# EAGLE design Motherboard (EAGLE 8.1.1)
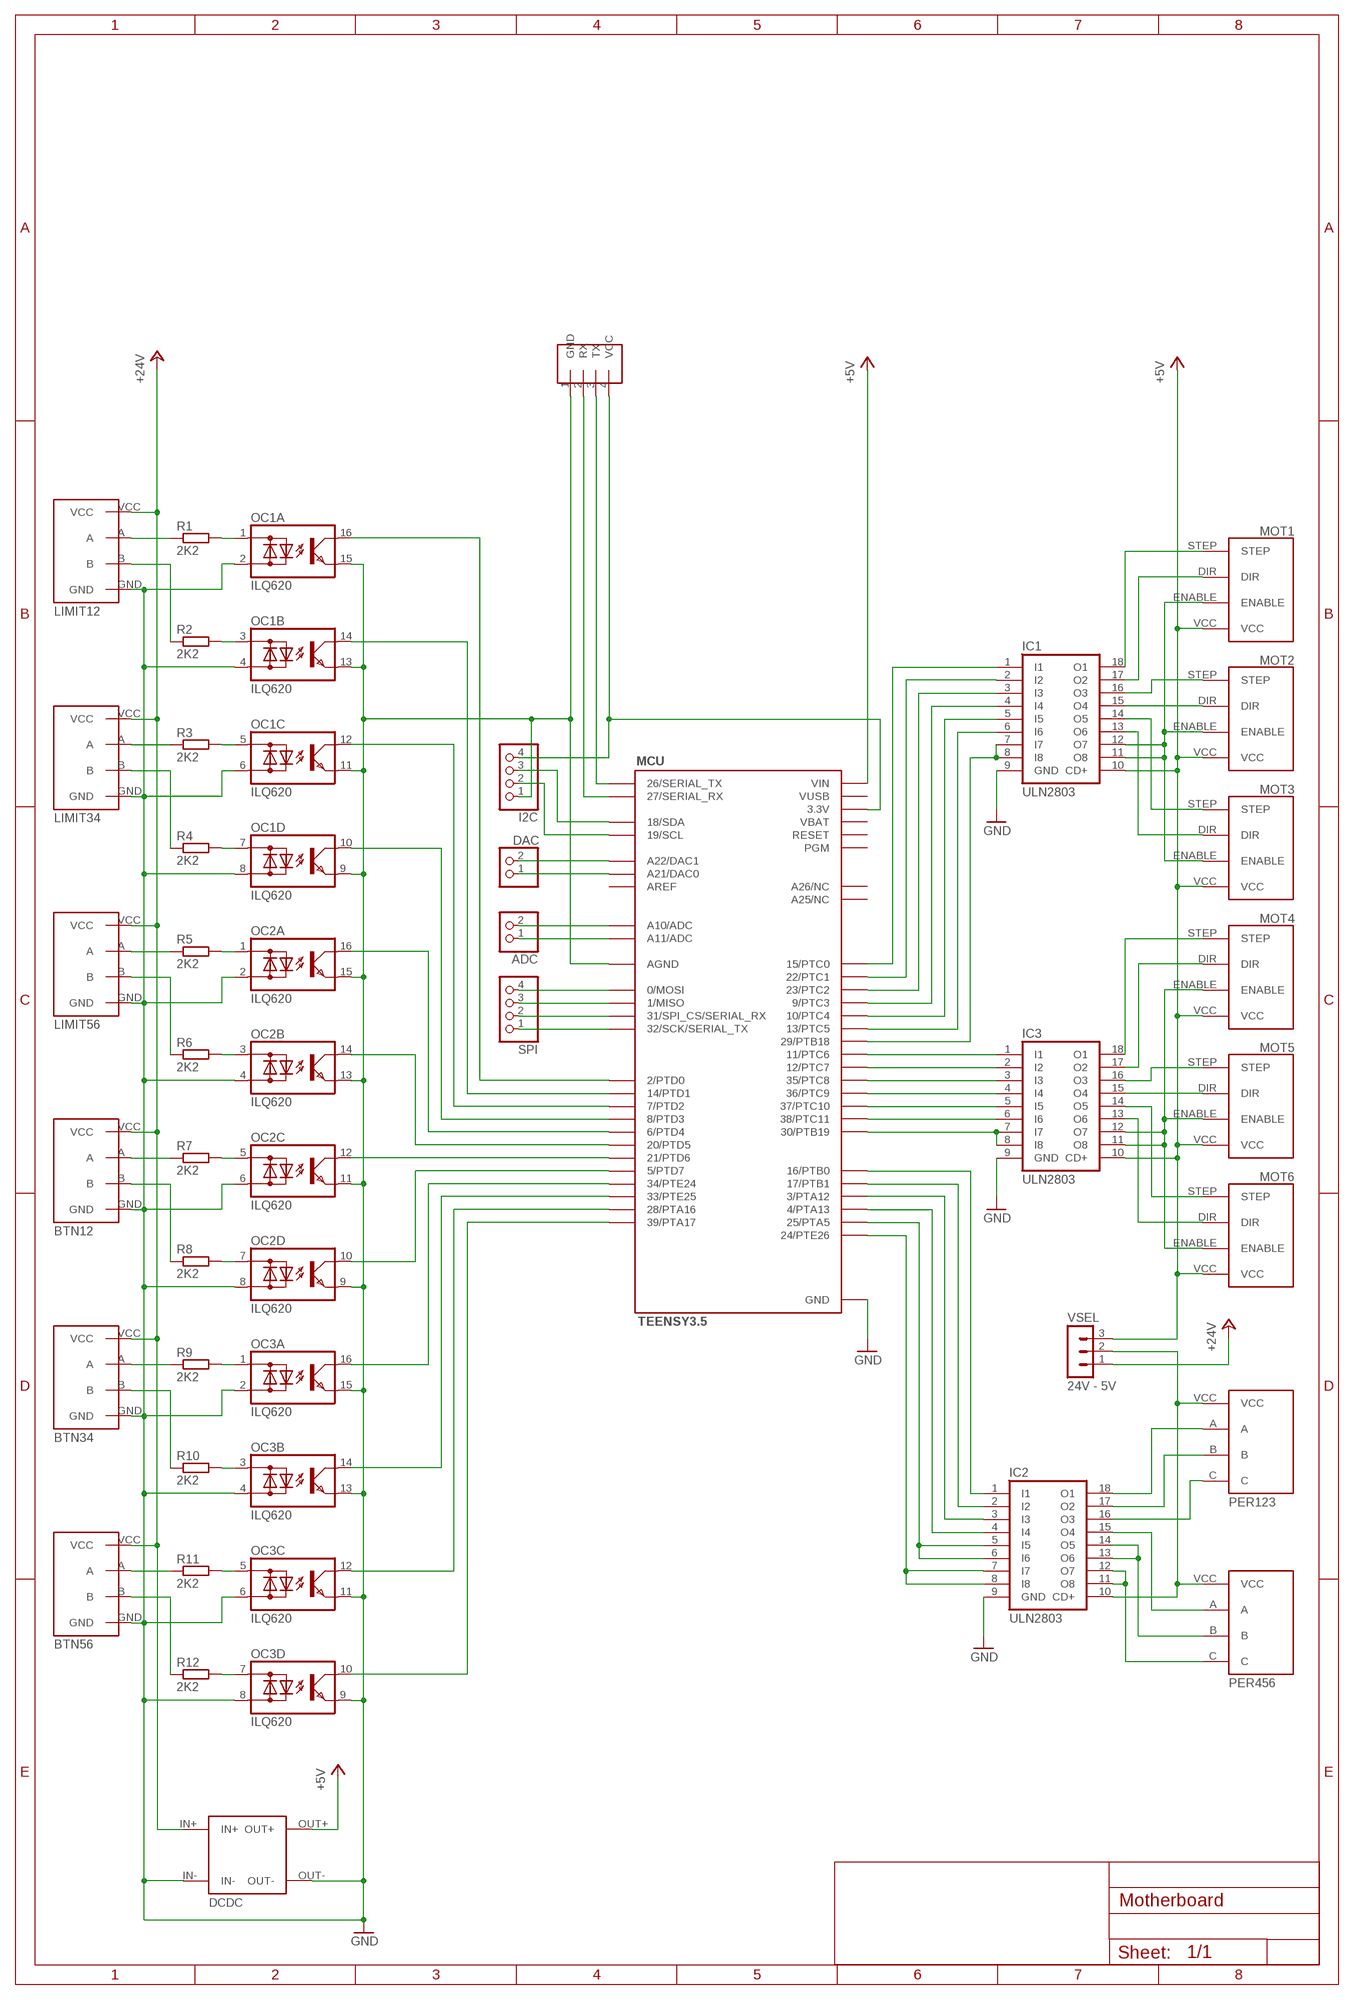
[diagram p0: schematic, sheet 1]

## Parts
ADC  PINHD-1X2  [1X02]
BTN12  CONN4B  [CONN4B]
BTN34  CONN4B  [CONN4B]
BTN56  CONN4B  [CONN4B]
DAC  PINHD-1X2  [1X02]
DCDC  DCDC  [DCDC]
I2C  PINHD-1X4  [1X04]
IC1  ULN2803  ULN2803A  [DIL18]
IC2  ULN2803  ULN2803A  [DIL18]
IC3  ULN2803  ULN2803A  [DIL18]
LIMIT12  CONN4B  [CONN4B]
LIMIT34  CONN4B  [CONN4B]
LIMIT56  CONN4B  [CONN4B]
MCU  TEENSY3.5  TEENSY_3.5_ALL_PINS  [TEENSY_3.5_ALL_PINS]
MOT1  CONN4  [CONN4]
MOT2  CONN4  [CONN4]
MOT3  CONN4  [CONN4]
MOT4  CONN4  [CONN4]
MOT5  CONN4  [CONN4]
MOT6  CONN4  [CONN4]
OC1  ILQ620  [DIL16]
OC2  ILQ620  [DIL16]
OC3  ILQ620  [DIL16]
PER123  CONN4C  [CONN4C]
PER456  CONN4C  [CONN4C]
R1  2K2  R-EU_0207/10  [0207/10]
R2  2K2  R-EU_0207/10  [0207/10]
R3  2K2  R-EU_0207/10  [0207/10]
R4  2K2  R-EU_0207/10  [0207/10]
R5  2K2  R-EU_0207/10  [0207/10]
R6  2K2  R-EU_0207/10  [0207/10]
R7  2K2  R-EU_0207/10  [0207/10]
R8  2K2  R-EU_0207/10  [0207/10]
R9  2K2  R-EU_0207/10  [0207/10]
R10  2K2  R-EU_0207/10  [0207/10]
R11  2K2  R-EU_0207/10  [0207/10]
R12  2K2  R-EU_0207/10  [0207/10]
SPI  PINHD-1X4  [1X04]
U$1  SERIAL-SUBD9-IF  [SERIAL-SUBD9-IF]
VSEL  24V - 5V  MA03-1  [MA03-1]

## Nets
3.3V: I2C.4 MCU.3.3V MCU.3.3V3(3.3V) MCU.3.3V4(3.3V) U$1.4(VCC)
+5V: DCDC.OUT+ IC1.10(CD+) IC3.10(CD+) MCU.VIN MOT1.VCC MOT2.VCC MOT3.VCC MOT4.VCC MOT5.VCC MOT6.VCC VSEL.3
+24V: BTN12.VCC BTN34.VCC BTN56.VCC DCDC.IN+ LIMIT12.VCC LIMIT34.VCC LIMIT56.VCC VSEL.1
+PER: IC2.10(CD+) PER123.VCC PER456.VCC VSEL.2
BT12A: BTN12.A R7.1
BT12AR: OC2.5(C:AC1) R7.2
BT12B: BTN12.B R8.1
BT12BR: OC2.7(D:AC1) R8.2
BT34A: BTN34.A R9.1
BT34AR: OC3.1(A:AC1) R9.2
BT34B: BTN34.B R10.1
BT34BR: OC3.3(B:AC1) R10.2
BT56A: BTN56.A R11.1
BT56AR: OC3.5(C:AC1) R11.2
BT56B: BTN56.B R12.1
BT56BR: OC3.7(D:AC1) R12.2
GND: BTN12.GND BTN34.GND BTN56.GND DCDC.IN- DCDC.OUT- I2C.1 IC1.9(GND) IC2.9(GND) IC3.9(GND) LIMIT12.GND LIMIT34.GND LIMIT56.GND MCU.AGND MCU.GND MCU.GND1(GND) MCU.GND3(GND) MCU.GND4(GND) MCU.GND6(GND) OC1.2(A:AC2) OC1.4(B:AC2) OC1.6(C:AC2) OC1.8(D:AC2) OC1.9(D:E) OC1.11(C:E) OC1.13(B:E) OC1.15(A:E) OC2.2(A:AC2) OC2.4(B:AC2) OC2.6(C:AC2) OC2.8(D:AC2) OC2.9(D:E) OC2.11(C:E) OC2.13(B:E) OC2.15(A:E) OC3.2(A:AC2) OC3.4(B:AC2) OC3.6(C:AC2) OC3.8(D:AC2) OC3.9(D:E) OC3.11(C:E) OC3.13(B:E) OC3.15(A:E) U$1.1(GND)
L12A: LIMIT12.A R1.1
L12AR: OC1.1(A:AC1) R1.2
L12B: LIMIT12.B R2.1
L12BR: OC1.3(B:AC1) R2.2
L34A: LIMIT34.A R3.1
L34AR: OC1.5(C:AC1) R3.2
L34B: LIMIT34.B R4.1
L34BR: OC1.7(D:AC1) R4.2
L56A: LIMIT56.A R5.1
L56AR: OC2.1(A:AC1) R5.2
L56B: LIMIT56.B R6.1
L56BR: OC2.3(B:AC1) R6.2
LDIR1: IC1.2(I2) MCU.22/A8(22/PTC1)
LDIR2: IC1.4(I4) MCU.9(9/PTC3)
LDIR3: IC1.6(I6) MCU.13(13/PTC5)
LDIR4: IC3.2(I2) MCU.12(12/PTC7)
LDIR5: IC3.4(I4) MCU.36/A17(36/PTC9)
LDIR6: IC3.6(I6) MCU.38/A19(38/PTC11)
LENABLE123: IC1.7(I7) IC1.8(I8) MCU.29(29/PTB18)
LENABLE456: IC3.7(I7) IC3.8(I8) MCU.30(30/PTB19)
LIN01: MCU.2(2/PTD0) OC1.16(A:C)
LIN02: MCU.14/A0(14/PTD1) OC1.14(B:C)
LIN03: MCU.7(7/PTD2) OC1.12(C:C)
LIN04: MCU.8(8/PTD3) OC1.10(D:C)
LIN05: MCU.6(6/PTD4) OC2.16(A:C)
LIN06: MCU.20/A6(20/PTD5) OC2.14(B:C)
LIN07: MCU.21/A7(21/PTD6) OC2.12(C:C)
LIN08: MCU.5(5/PTD7) OC2.10(D:C)
LIN09: MCU.34/A15(34/PTE24) OC3.16(A:C)
LIN10: MCU.33/A14(33/PTE25) OC3.14(B:C)
LIN11: MCU.28(28/PTA16) OC3.12(C:C)
LIN12: MCU.39/A20(39/PTA17) OC3.10(D:C)
LPER1A: IC2.1(I1) MCU.16/A2(16/PTB0)
LPER1B: IC2.2(I2) MCU.17/A3(17/PTB1)
LPER1C: IC2.3(I3) MCU.3(3/PTA12)
LPER2A: IC2.4(I4) MCU.4(4/PTA13)
LPER2B: IC2.5(I5) IC2.6(I6) MCU.25(25/PTA5)
LPER2C: IC2.7(I7) IC2.8(I8) MCU.24(24/PTE26)
LSTEP1: IC1.1(I1) MCU.15/A1(15/PTC0)
LSTEP2: IC1.3(I3) MCU.23/A9(23/PTC2)
LSTEP3: IC1.5(I5) MCU.10(10/PTC4)
LSTEP4: IC3.1(I1) MCU.11(11/PTC6)
LSTEP5: IC3.3(I3) MCU.35/A16(35/PTC8)
LSTEP6: IC3.5(I5) MCU.37/A18(37/PTC10)
M1DIR: IC1.17(O2) MOT1.DIR
M1STEP: IC1.18(O1) MOT1.STEP
M2DIR: IC1.15(O4) MOT2.DIR
M2STEP: IC1.16(O3) MOT2.STEP
M3DIR: IC1.13(O6) MOT3.DIR
M3STEP: IC1.14(O5) MOT3.STEP
M4DIR: IC3.17(O2) MOT4.DIR
M4STEP: IC3.18(O1) MOT4.STEP
M5DIR: IC3.15(O4) MOT5.DIR
M5STEP: IC3.16(O3) MOT5.STEP
M6DIR: IC3.13(O6) MOT6.DIR
M6STEP: IC3.14(O5) MOT6.STEP
M123ENABLE: IC1.11(O8) IC1.12(O7) MOT1.ENABLE MOT2.ENABLE MOT3.ENABLE
M456ENABLE: IC3.11(O8) IC3.12(O7) MOT4.ENABLE MOT5.ENABLE MOT6.ENABLE
N$1: I2C.3 MCU.18/A4(18/SDA)
N$2: I2C.2 MCU.19/A5(19/SCL)
N$3: DAC.2 MCU.A22(A22/DAC1)
N$4: DAC.1 MCU.A21(A21/DAC0)
N$5: ADC.2 MCU.A10(A10/ADC)
N$6: ADC.1 MCU.A11(A11/ADC)
N$7: MCU.0(0/MOSI) SPI.4
N$8: MCU.1(1/MISO) SPI.3
N$9: MCU.31/A12(31/SPI_CS/SERIAL_RX) SPI.2
N$10: MCU.32/A13(32/SCK/SERIAL_TX) SPI.1
PER123A: IC2.18(O1) PER123.A
PER123B: IC2.17(O2) PER123.B
PER123C: IC2.16(O3) PER123.C
PER456A: IC2.15(O4) PER456.A
PER456B: IC2.13(O6) IC2.14(O5) PER456.B
PER456C: IC2.11(O8) IC2.12(O7) PER456.C
SERIALRX: MCU.27(27/SERIAL_RX) U$1.2(RX)
SERIALTX: MCU.26(26/SERIAL_TX) U$1.3(TX)
Unconnected: MCU.A25(A25/NC) MCU.A26(A26/NC) MCU.PGM MCU.RESET

## Power pins joined to a net without a drawn wire
AREF: MCU.AREF
VBAT: MCU.VBAT
VUSB: MCU.VUSB

## Library data of the parts
ADC DAC = pinhead:PINHD-1X2: PIN HEADER
BTN12 BTN34 BTN56 LIMIT12 LIMIT34 LIMIT56 = Mooov2:CONN4B
DCDC = Mooov2:DCDC
I2C SPI = pinhead:PINHD-1X4: PIN HEADER
IC1-IC3 = uln-udn:ULN2803A: DRIVER ARRAY
MCU = Mooov2:TEENSY_3.5_ALL_PINS: All PIN version of the Teensy 3.5. Note: the NC pin is not shown in symbol package, not connected here either.
MOT1-MOT6 = Mooov2:CONN4
OC1-OC3 = optocoupler2:ILQ620: SIEMENS OPTO COUPLER
PER123 PER456 = Mooov2:CONN4C
R1-R12 = rcl:R-EU_: RESISTOR, European symbol
U$1 = Mooov2:SERIAL-SUBD9-IF
VSEL = con-lstb:MA03-1: PIN HEADER; OC_FARNELL: unknown; OC_NEWARK: unknown

## Board
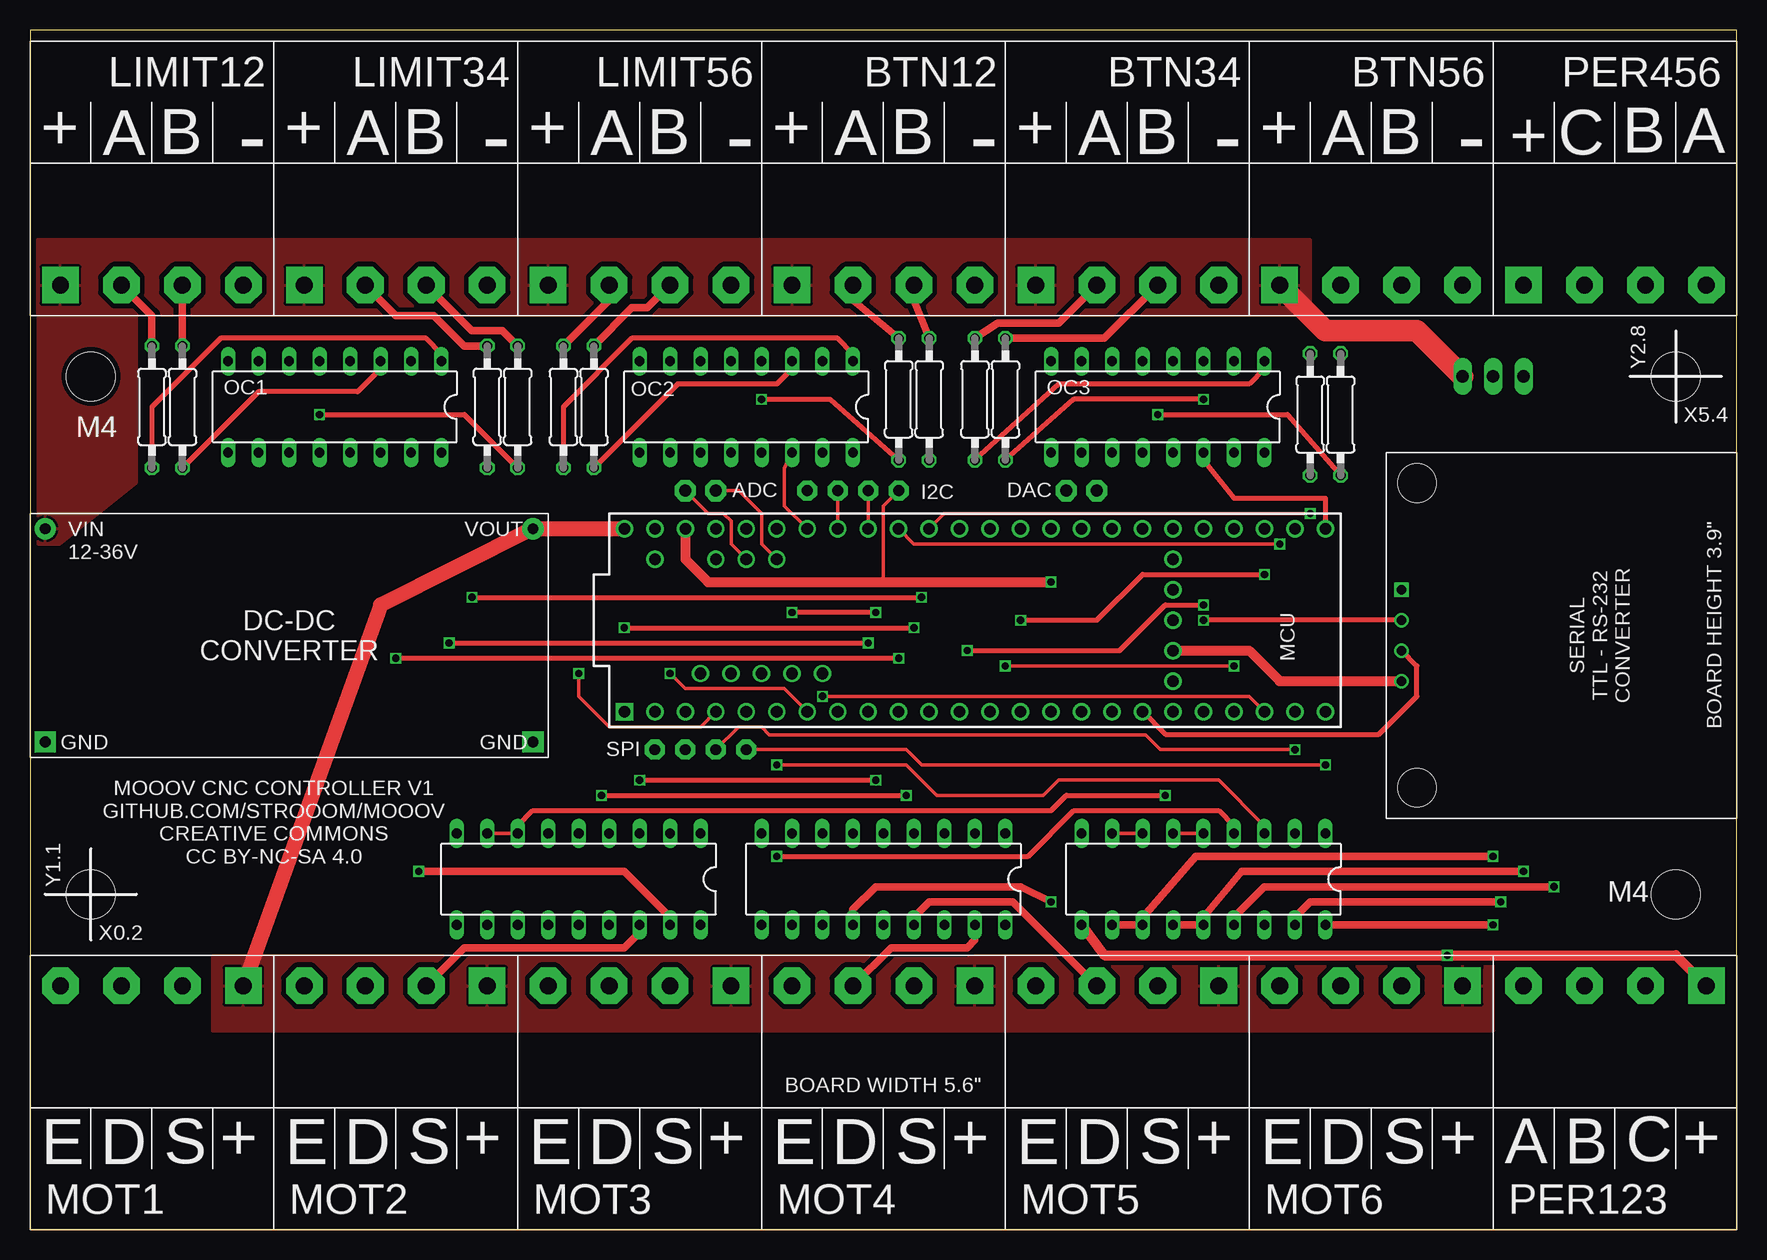
[diagram p1: board, top side]
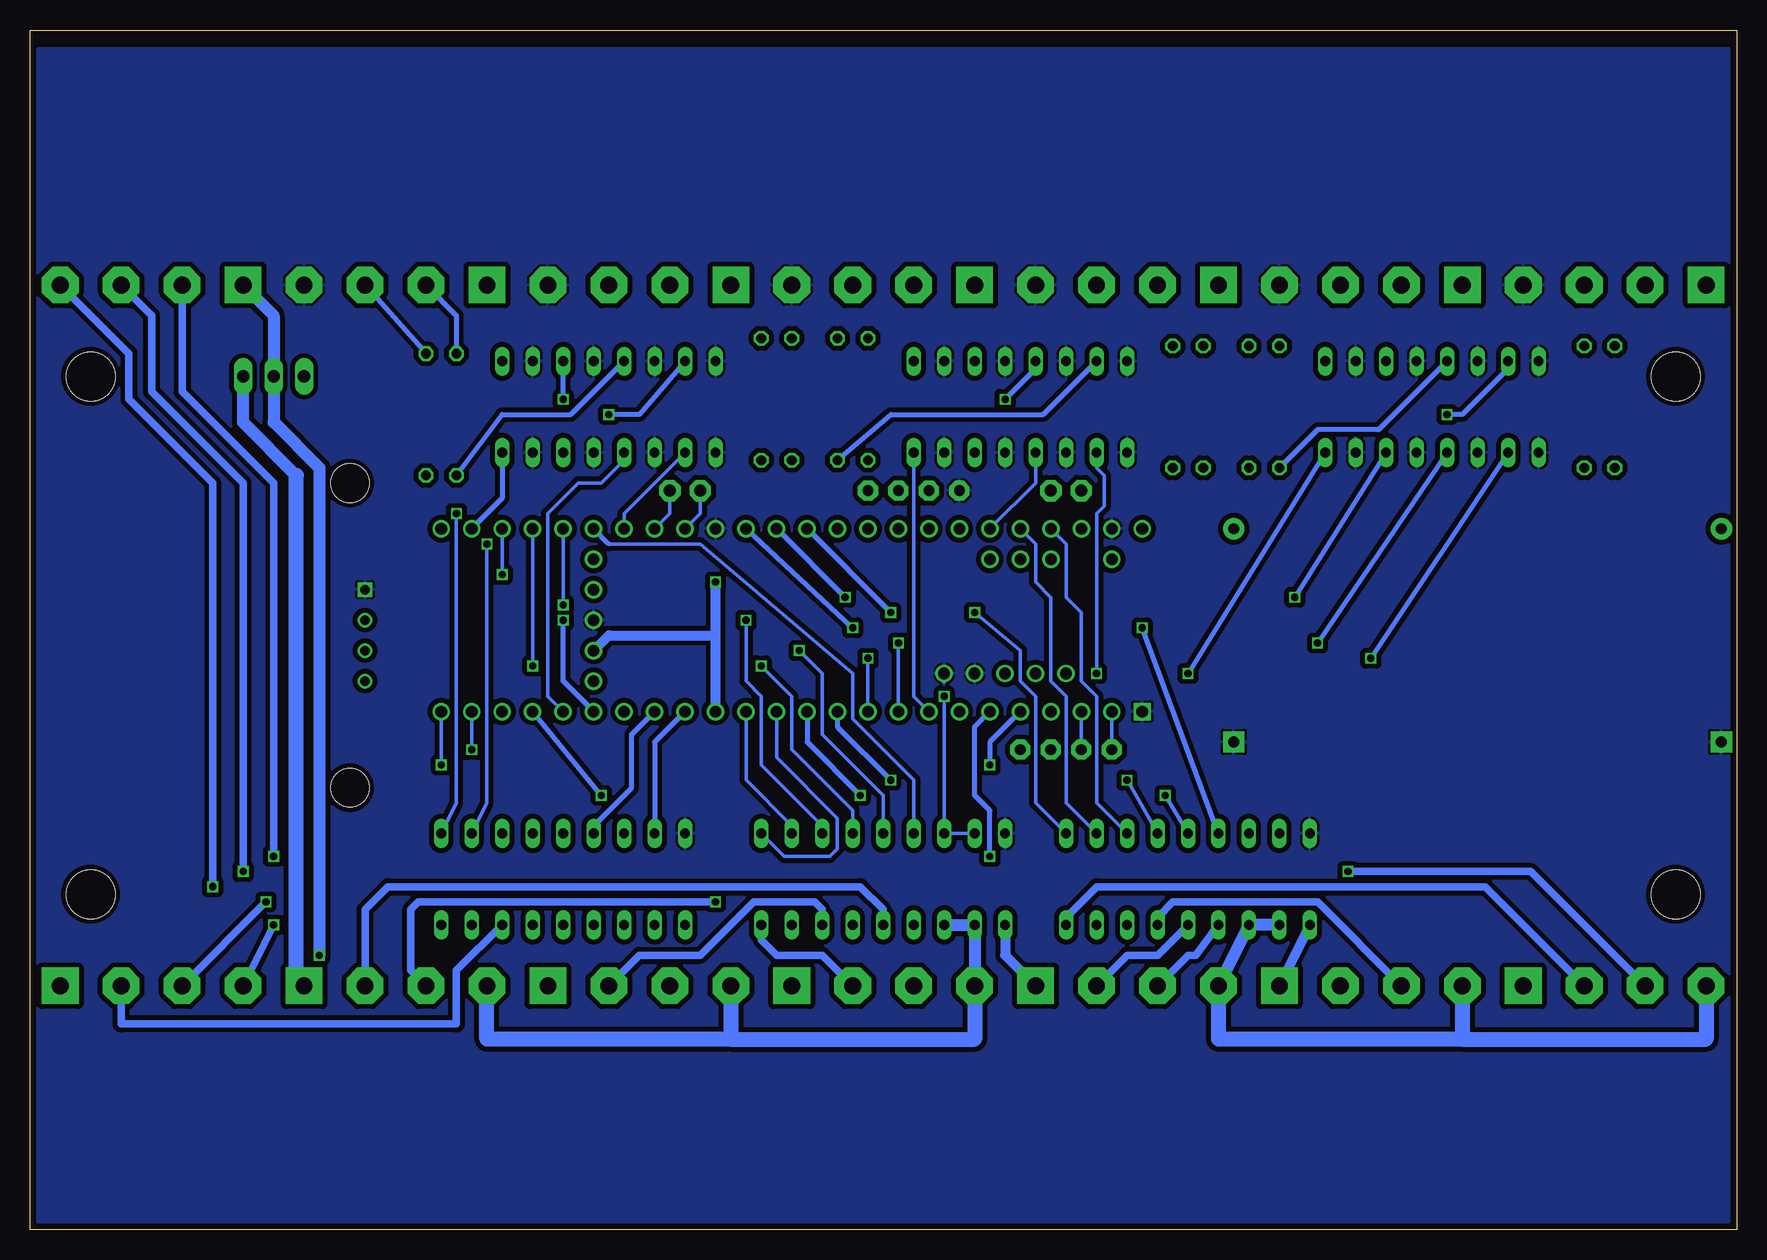
[diagram p2: board, bottom side, seen from below]

Size 142.22 x 100 mm. Coordinates in mm from the lower left corner, seen from the top.
Outline: 0,0 142.22,0 142.22,100 0,100 0,0
Copper layers (1*16): Top 0.018mm / dielectric 1.55mm / Bottom 0.018mm
Design rules "eC_2Layer_PClass6_BaseCopperO18_eCDefault *": minimum track width 10mil, minimum drill 0.35mm, track to track 10mil, track to pad 10mil, pad to pad 10mil, via to via 10mil, smd to smd 0mil, copper to edge 0.25mm, drill to drill 0.35mm, minimum pad ring 0.175mm, minimum via ring 0.125mm, stop-mask expansion 0mil, vias tented up to drill 0.45mm, thermal gap 0.2mm
Holes 4.06 mm at 5.08,27.94 5.08,71.12 137.16,71.12 137.16,27.94

### Footprints (pad centres in the part's own frame; a part is rotated, then mirrored left to right if it is on the bottom)
1X02 = drill 1.016 pad 1.778 octagon: 1 -1.27,0; 2 1.27,0
CONN4B = drill 1.4 pad 3.048 octagon: A 0,-5.08; B 0,-10.16; GND 0,-15.24 | drill 1.4 pad 3.048 square: VCC 0,0
DCDC = drill 0.9 pad 1.778: IN+ 0,0; OUT+ 40.64,0 | drill 0.9 pad 1.778 square: IN- 0,-17.78; OUT- 40.64,-17.78
1X04 = drill 0.9 pad 1.676 octagon: 1 -3.81,0; 2 -1.27,0; 3 1.27,0; 4 3.81,0
DIL18 = drill 0.813 long: 1 -10.16,-3.81; 2 -7.62,-3.81; 3 -5.08,-3.81; 4 -2.54,-3.81; 5 0,-3.81; 6 2.54,-3.81; 7 5.08,-3.81; 8 7.62,-3.81; 9 10.16,-3.81; 10 10.16,3.81; 11 7.62,3.81; 12 5.08,3.81; 13 2.54,3.81; 14 0,3.81; 15 -2.54,3.81; 16 -5.08,3.81; 17 -7.62,3.81; 18 -10.16,3.81
TEENSY_3.5_ALL_PINS = drill 0.965: 0 -7.62,27.94; 1 -7.62,25.4; 2 -7.62,22.86; 3 -7.62,20.32; 3.3V 7.62,25.4; 3.3V3 -7.62,-5.08; 3.3V4 -2.54,-15.24; 4 -7.62,17.78; 5 -7.62,15.24; 6 -7.62,12.7; 7 -7.62,10.16; 8 -7.62,7.62; 9 -7.62,5.08; 10 -7.62,2.54; 11 -7.62,0; 12 -7.62,-2.54; 13 7.62,-2.54; 14/A0 7.62,0; 15/A1 7.62,2.54; 16/A2 7.62,5.08; 17/A3 7.62,7.62; 18/A4 7.62,10.16; 19/A5 7.62,12.7; 20/A6 7.62,15.24; 21/A7 7.62,17.78; 22/A8 7.62,20.32; 23/A9 7.62,22.86; 24 -7.62,-7.62; 25 -7.62,-10.16; 26 -7.62,-12.7; 27 -7.62,-15.24; 28 -7.62,-17.78; 29 -7.62,-20.32; 30 -7.62,-22.86; 31/A12 -7.62,-25.4; 32/A13 -7.62,-27.94; 33/A14 7.62,-27.94; 34/A15 7.62,-25.4; 35/A16 7.62,-22.86; 36/A17 7.62,-20.32; 37/A18 7.62,-17.78; 38/A19 7.62,-15.24; 39/A20 7.62,-12.7; A10 5.08,20.32; A11 5.08,17.78; A21 7.62,-10.16; A22 7.62,-7.62; A25 -4.445,19.05; A26 -4.445,21.59; AGND 7.62,27.94; AREF 5.08,22.86; GND1 7.62,-5.08; GND3 -4.445,16.51; GND4 -4.445,13.97; GND6 0,-15.24; NC -4.445,24.13; PGM 2.54,-15.24; RESET 5.08,-15.24; VBAT -5.08,-15.24; VIN 7.62,30.48; VUSB 5.08,27.94 | drill 0.965 square: GND -7.62,30.48
CONN4 = drill 1.4 pad 3.048 octagon: DIR 0,-10.16; ENABLE 0,-15.24; STEP 0,-5.08 | drill 1.4 pad 3.048 square: VCC 0,0
DIL16 = drill 0.813 long: 1 -8.89,-3.81; 2 -6.35,-3.81; 3 -3.81,-3.81; 4 -1.27,-3.81; 5 1.27,-3.81; 6 3.81,-3.81; 7 6.35,-3.81; 8 8.89,-3.81; 9 8.89,3.81; 10 6.35,3.81; 11 3.81,3.81; 12 1.27,3.81; 13 -1.27,3.81; 14 -3.81,3.81; 15 -6.35,3.81; 16 -8.89,3.81
CONN4C = drill 1.4 pad 3.048 octagon: A 0,-15.24; B 0,-10.16; C 0,-5.08 | drill 1.4 pad 3.048 square: VCC 0,0
0207/10 = drill 0.813 octagon: 1 -5.08,0; 2 5.08,0
SERIAL-SUBD9-IF = drill 0.8 square: 1 0,0 | drill 0.8: 2 0,-2.54; 3 0,-5.08; 4 0,-7.62 | hole 3.2: 1.27,8.89; 1.27,-16.51
MA03-1 = drill 1.016 long: 1 -2.54,0; 2 0,0; 3 2.54,0

### Placement (x,y rotation side)
ADC  55.88,61.59 180 top
BTN12  63.5,78.74 90 top
BTN34  83.82,78.74 90 top
BTN56  104.14,78.74 90 top
DAC  87.63,61.59 180 top
DCDC  1.27,58.42 0 top
I2C  68.58,61.59 0 top
IC1  45.72,29.21 180 top
IC2  97.79,29.21 180 top
IC3  71.12,29.21 180 top
LIMIT12  2.54,78.74 90 top
LIMIT34  22.86,78.74 90 top
LIMIT56  43.18,78.74 90 top
MCU  80.01,50.8 90 top
MOT1  17.78,20.32 270 top
MOT2  38.1,20.32 270 top
MOT3  58.42,20.32 270 top
MOT4  78.74,20.32 270 top
MOT5  99.06,20.32 270 top
MOT6  119.38,20.32 270 top
OC1  25.4,68.58 180 top
OC2  59.69,68.58 180 top
OC3  93.98,68.58 180 top
PER123  139.7,20.32 270 top
PER456  124.46,78.74 90 top
R1  10.16,68.58 270 top
R2  12.7,68.58 270 top
R3  38.1,68.58 270 top
R4  40.64,68.58 270 top
R5  44.45,68.58 270 top
R6  46.99,68.58 270 top
R7  72.39,69.22 270 top
R8  74.93,69.22 270 top
R9  78.74,69.22 270 top
R10  81.28,69.22 270 top
R11  106.68,67.94 270 top
R12  109.22,67.94 270 top
SPI  55.88,40.01 180 top
U$1  114.3,53.34 0 top
VSEL  121.92,71.12 0 top

### Tracks (layer width: path | path; a pad name or v marks a point on that pad's centre or on a via)
3.3V  (via drill 0.6)
  Top 0.305: I2C.4 71.12,60.33 71.12,53.98
  Top 0.813: MCU.3.3V 54.61,55.88 56.52,53.98 71.12,53.98 v85.09,53.98 | MCU.3.3V4 101.6,48.26 104.14,45.72 U$1.4
  Bottom 0.813: MCU.3.3V3 85.09,49.53 | MCU.3.3V4 93.98,49.53 85.09,49.53 | 85.09,49.53 v85.09,53.98
+5V
  Top 1.27: MOT1.VCC 29.21,52.07 DCDC.OUT+ MCU.VIN
  Bottom 0.813: IC1.10 MOT2.VCC | IC3.10 60.96,22.86 MOT3.VCC
  Bottom 1.016: MOT6.VCC 120.02,20.95 | 120.02,62.87 124.46,67.31 VSEL.3
  Bottom 1.27: 120.02,20.95 120.02,62.87
  pour Top (isolate 0.406): 15.24,22.86 121.92,22.86 121.92,16.51 15.24,16.51
+24V
  Top 1.778: BTN56.VCC 107.95,74.93 115.57,74.93 VSEL.1
  pour Top (isolate 0.406): 0.64,76.2 0.64,57.15 2.54,57.15 8.89,62.23 8.89,76.2 1.27,76.2
  pour Top (isolate 0.406): 0.64,82.55 106.68,82.55 106.68,76.2 0.64,76.2
+PER  (via drill 0.6)
  Top 0.813: PER123.VCC 137.16,22.86 v118.11,22.86 89.53,22.86 IC2.10
  Bottom 1.016: PER456.VCC 121.92,76.2 VSEL.2 121.92,67.31 118.11,63.5 v118.11,22.86
BT12A
  Top 0.61: BTN12.A 68.58,77.47 R7.1
BT12AR  (via drill 0.6)
  Top 0.406: v60.96,69.22 66.67,69.22 R7.2
  Bottom 0.305: OC2.5 58.42,71.75
  Bottom 0.406: 58.42,71.75 v60.96,69.22
BT12B
  Top 0.61: R8.1 73.66,77.47 BTN12.B
BT12BR
  Bottom 0.406: OC2.7 57.78,67.94 70.48,67.94 R8.2
BT34A
  Top 0.61: BTN34.A 85.72,75.56 80.64,75.56 R9.1
BT34AR
  Top 0.406: OC3.1 102.87,71.75 101.6,70.48 85.72,70.48 R9.2
BT34B
  Top 0.61: BTN34.B 89.53,74.3 R10.1
BT34BR  (via drill 0.6)
  Top 0.406: v97.79,69.22 87,69.22 R10.2
  Bottom 0.406: v97.79,69.22 OC3.3
BT56A
  Bottom 0.406: BTN56.A 106.68,76.2 R11.1
BT56AR
  Bottom 0.406: OC3.5 97.16,67.94 102.87,67.94 R11.2
BT56B
  Bottom 0.406: BTN56.B R12.1
BT56BR  (via drill 0.6)
  Top 0.406: v93.98,67.94 104.78,67.94 R12.2
  Bottom 0.406: OC3.7 91.44,67.94 v93.98,67.94
GND
  Bottom 0.406: MCU.GND4 66.04,45.72
  pour Bottom (isolate 0.406): 0.64,0.64 0.64,98.42 141.6,98.42 141.6,0.64
L12A
  Top 0.61: R1.1 10.16,76.2 LIMIT12.A
L12AR
  Top 0.406: OC1.1 34.29,73.03 33.02,74.3 15.88,74.3 10.16,68.58 R1.2
L12B
  Top 0.61: R2.1 LIMIT12.B
L12BR
  Top 0.406: OC1.3 29.21,71.75 27.3,69.85 19.05,69.85 R2.2
L34A
  Top 0.61: R3.1 36.2,73.66 33.66,76.2 30.48,76.2 LIMIT34.A
L34AR
  Bottom 0.406: OC1.5 29.84,66.67 34.92,66.67 R3.2
L34B
  Top 0.61: LIMIT34.B 36.83,74.93 39.37,74.93 R4.1
L34BR  (via drill 0.6)
  Top 0.406: v24.13,67.94 36.2,67.94 R4.2
  Bottom 0.406: OC1.7 19.05,71.75 22.86,67.94 v24.13,67.94
L56A
  Top 0.61: R5.1 48.26,77.47 LIMIT56.A
L56AR
  Top 0.406: OC2.1 68.58,73.03 67.31,74.3 50.16,74.3 44.45,68.58 R5.2
L56B
  Top 0.61: LIMIT56.B 51.44,76.83 50.16,76.83 R6.1
L56BR
  Top 0.305: 47.31,63.82 R6.2
  Top 0.406: OC2.3 63.5,71.75 62.23,70.48 53.98,70.48 47.31,63.82
LDIR1
  Bottom 0.305: MCU.22/A8 58.42,57.15 58.42,53.98 57.15,52.7 57.15,45.72 55.88,44.45 55.88,35.6 55.87,35.55 IC1.2
LDIR2  (via drill 0.6)
  Top 0.406: v50.8,37.47 v70.48,37.47
  Bottom 0.305: IC1.4 v50.8,37.47
  Bottom 0.406: MCU.9 74.93,41.91 v70.48,37.47
LDIR3  (via drill 0.6)
  Top 0.406: v49.53,50.16 v73.66,50.16
  Bottom 0.406: IC1.6 v49.53,50.16 | MCU.13 v73.66,50.16
LDIR4
  Bottom 0.305: IC3.2 78.74,33.66 82.55,37.47 MCU.12
LDIR5  (via drill 0.6)
  Top 0.305: v81.28,46.99 v100.33,46.99
  Bottom 0.305: v100.33,46.99 MCU.36/A17 | IC3.4 73.66,34.92 78.74,40.01 78.74,44.45 v81.28,46.99
LDIR6
  Bottom 0.305: IC3.6 68.58,37.47 73.66,42.55 73.66,46.35 86.36,57.15 93.98,57.15
  Bottom 0.406: 93.98,57.15 MCU.38/A19
LENABLE123  (via drill 0.6)
  Top 0.305: IC1.8 IC1.7
  Top 0.406: IC1.7 40.64,33.66 41.91,34.92 85.09,34.92 86.36,36.2 v94.61,36.2
  Bottom 0.406: v94.61,36.2 MCU.29
LENABLE456  (via drill 0.6)
  Top 0.305: v66.04,44.45 101.6,44.45 MCU.30
  Bottom 0.305: IC3.8 IC3.7 v66.04,44.45
LIN01  (via drill 0.6)
  Top 0.305: MCU.2 55.88,41.91 48.26,41.91 45.72,44.45 v45.72,46.35
  Bottom 0.406: OC1.16 v45.72,46.35
LIN02  (via drill 0.6)
  Top 0.406: v36.83,52.7 v74.3,52.7
  Bottom 0.406: OC1.14 v36.83,52.7 | MCU.14/A0 v74.3,52.7
LIN03  (via drill 0.6)
  Top 0.406: v34.92,48.9 v69.85,48.9
  Bottom 0.305: MCU.7 v69.85,48.9
  Bottom 0.406: OC1.12 v34.92,48.9
LIN04  (via drill 0.6)
  Top 0.406: v72.39,47.62 v30.48,47.62
  Bottom 0.305: MCU.8 v72.39,47.62
  Bottom 0.406: OC1.10 v30.48,47.62
LIN05
  Bottom 0.305: MCU.6 68.58,44.45 OC2.16
LIN06
  Top 0.305: OC2.14 62.87,63.5 62.87,60.33 MCU.20/A6
LIN07
  Bottom 0.305: MCU.21/A7 58.42,62.23 OC2.12
LIN08  (via drill 0.6)
  Top 0.305: v53.34,46.35 54.61,45.09 62.87,45.09 MCU.5
  Bottom 0.305: OC2.10 53.34,63.5 52.7,62.87 52.7,60.33 53.34,59.69 v53.34,46.35
LIN09
  Bottom 0.406: OC3.16 102.87,60.96 MCU.34/A15
LIN10
  Top 0.406: OC3.14 97.79,64.14 100.33,60.96 107.95,60.96 MCU.33/A14
LIN11
  Bottom 0.305: MCU.28 99.06,44.45 99.06,59.69 96.52,62.23 94.61,62.23 92.71,64.14 OC3.12
LIN12
  Bottom 0.305: OC3.10 92.71,59.69 MCU.39/A20
LPER1A  (via drill 0.6)
  Top 0.305: MCU.16/A2 76.2,59.69 v106.68,59.69
  Bottom 0.305: IC2.1 106.68,35.56 v106.68,59.69
LPER1B  (via drill 0.6)
  Top 0.305: MCU.17/A3 73.66,57.15 v104.14,57.15
  Bottom 0.305: IC2.2 104.14,35.56 v104.14,57.15
LPER1C  (via drill 0.6)
  Top 0.305: v62.23,38.73 73.03,38.73 75.56,36.2 84.45,36.2 85.72,37.47 99.06,37.47 102.87,33.66 IC2.3
  Bottom 0.406: MCU.3 62.23,40.64 v62.23,38.73
LPER2A  (via drill 0.6)
  Top 0.406: IC2.4 100.33,33.66 99.06,34.92 87,34.92 83.19,31.11 v62.23,31.11
  Bottom 0.406: v62.23,31.11 62.23,34.92 63.5,36.2 63.5,41.91 MCU.4
LPER2B
  Top 0.305: IC2.5 IC2.6
  Bottom 0.406: IC2.6 95.25,33.66 92.08,36.83 92.08,41.27 MCU.25
LPER2C
  Top 0.305: IC2.8 IC2.7
  Bottom 0.406: MCU.24 90.17,40.64 IC2.8
LSTEP1  (via drill 0.6)
  Top 0.406: v70.48,51.44 v63.5,51.44
  Bottom 0.305: v63.5,51.44 59.69,48.26 59.69,45.72 58.42,44.45 58.42,35.56 IC1.1
  Bottom 0.406: v70.48,51.44 MCU.15/A1
LSTEP2
  Bottom 0.305: IC1.3 53.33,35.55 53.34,35.6 53.34,44.45 54.61,45.72 54.61,51.44 55.88,52.7 55.88,57.15 MCU.23/A9
LSTEP3  (via drill 0.6)
  Top 0.406: v47.62,36.2 v73.03,36.2
  Bottom 0.305: IC1.5 v47.62,36.2
  Bottom 0.406: MCU.10 77.47,40.64 v73.03,36.2
LSTEP4
  Bottom 0.305: IC3.1 79.38,31.11 75.56,31.11 74.93,31.75 74.93,34.29 80.01,39.37 MCU.11
LSTEP5  (via drill 0.6)
  Top 0.406: v82.55,50.8 88.9,50.8 92.71,54.61 v102.87,54.61
  Bottom 0.305: v102.87,54.61 MCU.35/A16 | IC3.3 76.2,33.66 81.28,38.73 81.28,44.45 82.55,45.72 v82.55,50.8
LSTEP6  (via drill 0.6)
  Top 0.406: v78.11,48.26 90.81,48.26 94.61,52.07 v97.79,52.07
  Bottom 0.305: v78.11,48.26 76.2,46.35 76.2,41.27 71.12,36.2 IC3.5 | v97.79,52.07 MCU.37/A18
M1DIR  (via drill 0.6)
  Top 0.61: IC1.17 53.34,26.04 49.53,29.84 v32.38,29.84
  Bottom 0.61: MOT1.DIR 17.14,29.84 v32.38,29.84
M1STEP
  Bottom 0.61: IC1.18 55.88,26.04 53.34,28.57 20.95,28.57 MOT1.STEP
M2DIR
  Bottom 0.61: IC1.15 48.26,26.04 46.99,27.3 34.92,27.3 MOT2.DIR
M2STEP
  Top 0.61: IC1.16 50.8,24.77 49.53,23.5 36.2,23.5 MOT2.STEP
M3DIR
  Bottom 0.61: MOT3.DIR 45.72,22.86 45.09,22.86 IC1.13
M3STEP
  Bottom 0.61: MOT3.STEP 50.8,22.86 48.26,22.86 IC1.14
M4DIR
  Top 0.61: MOT4.DIR 71.75,23.5 78.11,23.5 78.74,24.13 IC3.17
M4STEP
  Bottom 0.61: MOT4.STEP 76.2,22.86 80.01,22.86 81.28,24.13 IC3.18
M5DIR
  Top 0.61: MOT5.DIR 81.92,27.3 74.93,27.3 73.66,26.04 IC3.15
M5STEP
  Bottom 0.61: MOT5.STEP 91.44,22.86 86.36,22.86 81.92,27.3 76.83,27.3 76.2,26.67 IC3.16
M6DIR  (via drill 0.6)
  Top 0.61: IC3.13 68.58,26.67 70.48,28.57 82.55,28.57 v85.09,27.3
  Bottom 0.61: MOT6.DIR 110.49,21.59 110.49,26.67 109.86,27.3 v85.09,27.3
M6STEP
  Bottom 0.61: MOT6.STEP 114.3,26.67 112.39,28.57 73.03,28.57 71.12,26.67 IC3.14
M123ENABLE
  Bottom 1.016: IC1.11 IC1.12 MOT3.ENABLE
  Bottom 1.27: MOT1.ENABLE 2.54,15.88 22.86,15.88 | 22.86,15.88 43.18,15.88 MOT3.ENABLE | MOT2.ENABLE 22.86,15.88
M456ENABLE
  Bottom 1.016: IC3.12 IC3.11 MOT4.ENABLE
  Bottom 1.27: MOT4.ENABLE 63.5,15.88 83.82,15.88 | 83.82,15.88 104.14,15.88 MOT6.ENABLE | MOT5.ENABLE 83.82,15.88
N$1
  Top 0.305: I2C.3 MCU.18/A4
N$2
  Top 0.305: I2C.2 MCU.19/A5
N$3
  Bottom 0.305: DAC.2 86.36,59.69 MCU.A22
N$4
  Bottom 0.305: DAC.1 88.9,59.69 MCU.A21
N$5
  Top 0.305: ADC.2 56.52,59.69 57.78,59.69 58.42,59.05 58.42,57.15 MCU.A10
N$6
  Top 0.305: MCU.A11 60.96,57.15 60.96,59.69 59.05,61.59 ADC.1
N$7
  Bottom 0.305: MCU.0 SPI.4
N$8
  Bottom 0.305: MCU.1 SPI.3
N$9  (via drill 0.6)
  Top 0.305: v105.41,40.01 94.21,40.01 92.96,41.25 61.62,41.25 60.96,41.91 59.05,41.91 SPI.2
  Bottom 0.305: MCU.31/A12 v105.41,40.01
N$10  (via drill 0.6)
  Top 0.305: v107.95,38.73 74.3,38.73 73.03,40.01 SPI.1
  Bottom 0.305: MCU.32/A13 v107.95,38.73
PER123A  (via drill 0.6)
  Top 0.61: IC2.18 v121.92,25.4
  Bottom 0.61: v121.92,25.4 PER123.A
PER123B  (via drill 0.6)
  Top 0.61: IC2.17 105.41,26.04 106.68,27.3 v122.56,27.3
  Bottom 0.61: v122.56,27.3 PER123.B
PER123C
  Bottom 0.61: IC2.16 106.68,21.59 106.68,17.14 134.62,17.14 PER123.C
PER456A  (via drill 0.6)
  Top 0.61: IC2.15 100.33,26.04 102.87,28.57 v127,28.57
  Bottom 0.61: v127,28.57 127,62.23 133.99,69.22 133.99,73.03 PER456.A
PER456B  (via drill 0.6)
  Top 0.61: IC2.13 IC2.14 97.79,26.04 100.97,29.84 v124.46,29.84
  Bottom 0.61: PER456.B 132.08,76.2 132.08,69.85 124.46,62.23 v124.46,29.84
PER456C  (via drill 0.6)
  Top 0.61: IC2.11 IC2.12 92.71,26.04 97.16,31.11 v121.92,31.11
  Bottom 0.61: PER456.C 129.54,69.85 121.92,62.23 v121.92,31.11
SERIALRX  (via drill 0.6)
  Top 0.406: U$1.2 v97.79,50.8
  Bottom 0.406: MCU.27 97.79,45.72 v97.79,50.8
SERIALTX
  Top 0.406: MCU.26 94.61,41.27 112.39,41.27 115.57,44.45 115.57,46.99 U$1.3

### Text on the board
tPlace: Y2.8 | X5.4 | M4 | BOARD HEIGHT 3.9" | MOOOV CNC CONTROLLER V1 / GITHUB.COM/STROOOM/MOOOV / CREATIVE COMMONS / CC BY-NC-SA 4.0 | Y1.1 | M4 | X0.2 | BOARD WIDTH 5.6"